# Altium schematic sheet P1.schdoc
size 297 x 209 mm; Company: 嘉立创EDA; Version: V1.0; Page Size: A4; @Project Name: PCB_Base; @Page Count: 1; @Update Date: 2025-12-15; @Create Date: 2025-12-15; @Schematic Name: Schematic1; @Page No: 0; @Page Name: P1; @Board Name: Board1; Border: 1; Title Block Position: 3; Size: A4; Width: 1170; Height: 825; Region Start: 1; X Region Count: 6; Y Region Count: 4; Blade Width: 10; Device: Drawing-Symbol_A4
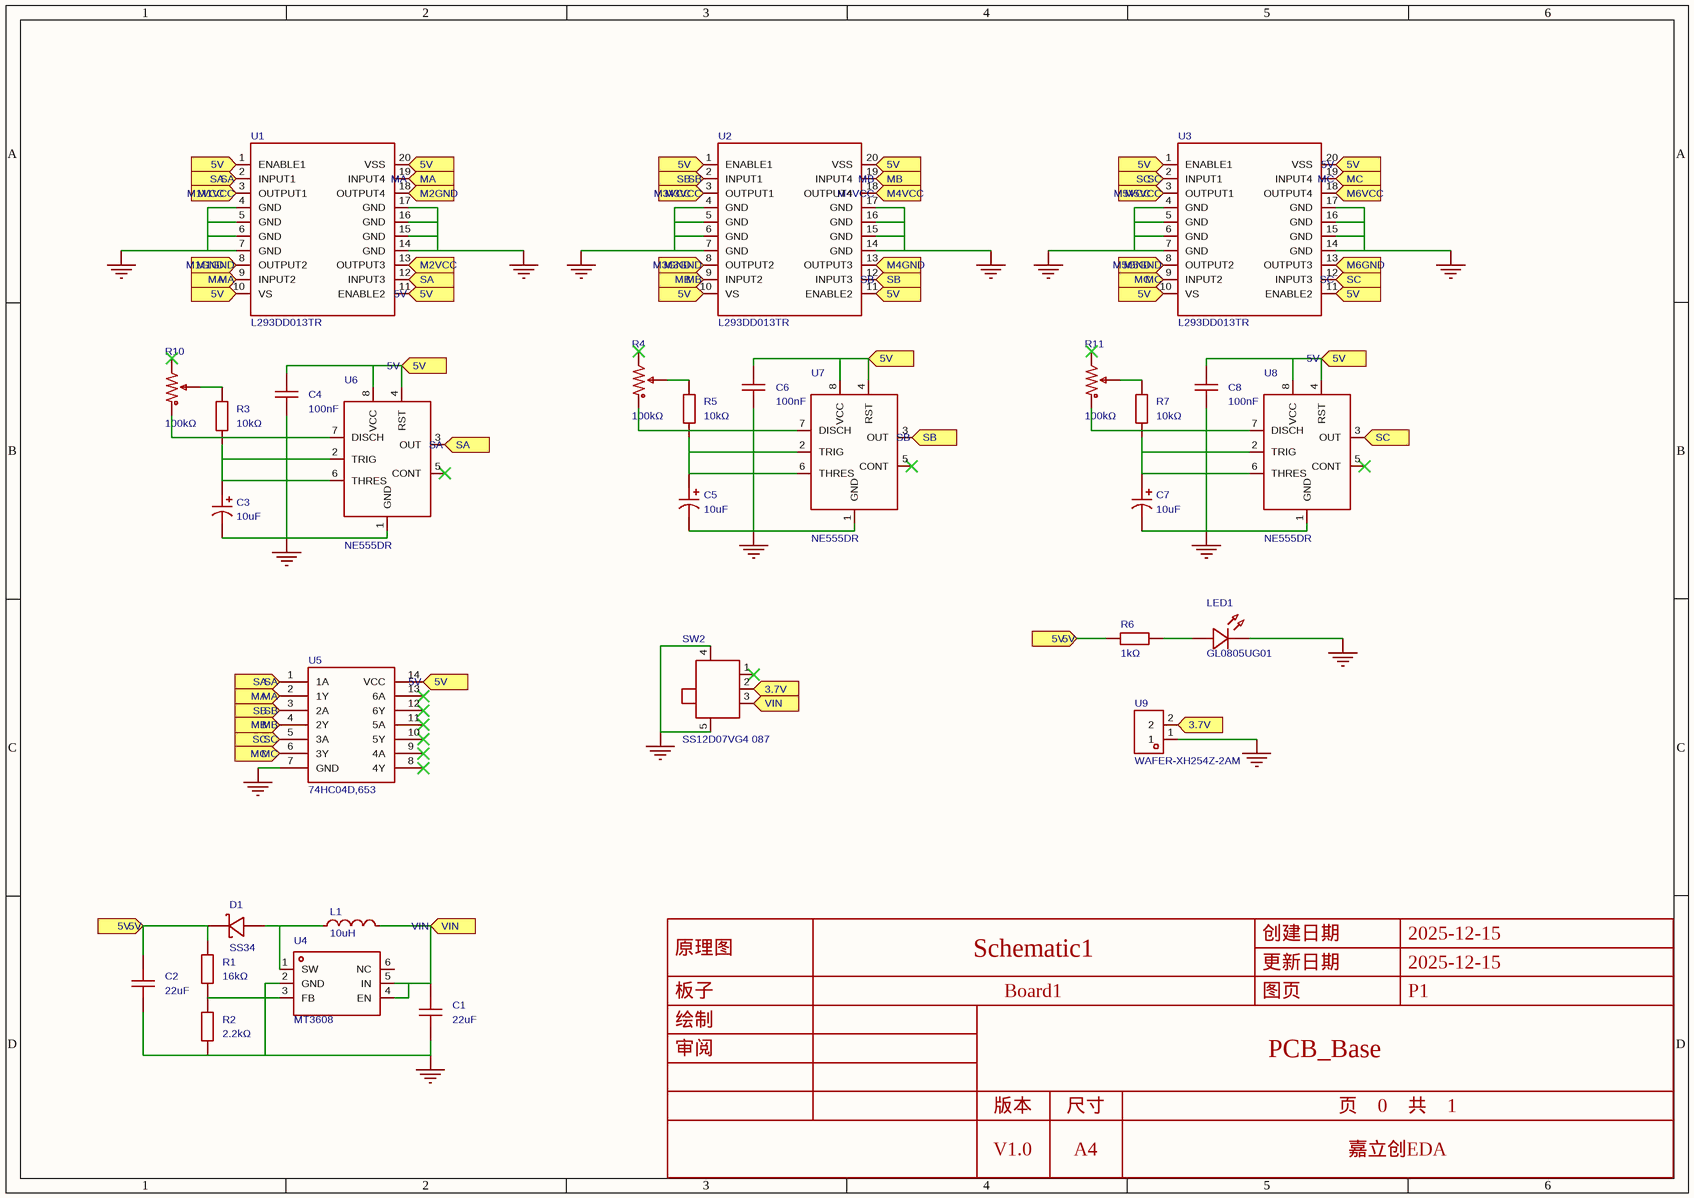
[diagram p0: P1.schdoc]

## Parts
C1  22uF  [C0805]
C2  22uF  [C0805]
C3  10uF  [CAP-SMD_BD4.0-L4.3-W4.3-LS5.1-FD]
C4  100nF  [C0805]
C5  10uF  [CAP-SMD_BD4.0-L4.3-W4.3-LS5.1-FD]
C6  100nF  [C0805]
C7  10uF  [CAP-SMD_BD4.0-L4.3-W4.3-LS5.1-FD]
C8  100nF  [C0805]
D1  SS34  [SMC_L6.9-W5.9-LS7.9-RD]
L1  10uH  [IND-SMD_L7.3-W6.8]
LED1  GL0805UG01  [LED0805-FD]
R1  16kΩ  [R0805]
R2  2.2kΩ  [R0805]
R3  10kΩ  [R0805]
R4  100kΩ  [RES-ADJ-SMD_JER33X-1-14]
R5  10kΩ  [R0805]
R6  1kΩ  [R0805]
R7  10kΩ  [R0805]
R10  100kΩ  [RES-ADJ-SMD_JER33X-1-14]
R11  100kΩ  [RES-ADJ-SMD_JER33X-1-14]
SW2  SS12D07VG4 087  [SW-TH_SS12D07VG4]
U1  L293DD013TR  [SOP-20_L13.2-W7.8-P1.27-LS10.4-BL]
U2  L293DD013TR  [SOP-20_L13.2-W7.8-P1.27-LS10.4-BL]
U3  L293DD013TR  [SOP-20_L13.2-W7.8-P1.27-LS10.4-BL]
U4  MT3608  [SOT-23-6_L2.9-W1.6-P0.95-LS2.8-BL]
U5  74HC04D,653  [SOIC-14_L8.7-W3.9-P1.27-LS6.0-BL]
U6  NE555DR  [SOIC-8_L4.9-W3.9-P1.27-LS6.0-BL]
U7  NE555DR  [SOIC-8_L4.9-W3.9-P1.27-LS6.0-BL]
U8  NE555DR  [SOIC-8_L4.9-W3.9-P1.27-LS6.0-BL]
U9  WAFER-XH254Z-2AM  [CONN-TH_2P-P2.50_XH-2A_3045048]

## Ports
3.7V (in), 5V (in), M1GND (in), M1VCC (in), M2GND (in), M2VCC (in), M3GND (in), M3VCC (in), M4GND (in), M4VCC (in), M5GND (in), M5VCC (in), M6GND (in), M6VCC (in), MA (in), MB (in), MC (in), SA (in), SB (in), SC (in), VIN (in)

## Nets
GND: C1.2 C2.2 C3.2 C4.1 C5.2 C6.1 C7.2 C8.1 LED1.2(C) R2.1 SW2.4 SW2.5 U1.4(GND) U1.5(GND) U1.6(GND) U1.7(GND) U1.14(GND) U1.15(GND) U1.16(GND) U1.17(GND) U2.4(GND) U2.5(GND) U2.6(GND) U2.7(GND) U2.14(GND) U2.15(GND) U2.16(GND) U2.17(GND) U3.4(GND) U3.5(GND) U3.6(GND) U3.7(GND) U3.14(GND) U3.15(GND) U3.16(GND) U3.17(GND) U4.2(GND) U5.7(GND) U6.1(GND) U7.1(GND) U8.1(GND) U9.1
3.7V: SW2.2 U9.2 ; port 3.7V
5V: C2.1 C4.2 C6.2 C8.2 D1.1(C) R1.2 R6.1 U1.1(ENABLE1) U1.10(VS) U1.11(ENABLE2) U1.20(VSS) U2.1(ENABLE1) U2.10(VS) U2.11(ENABLE2) U2.20(VSS) U3.1(ENABLE1) U3.10(VS) U3.11(ENABLE2) U3.20(VSS) U5.14(VCC) U6.4(RST) U6.8(VCC) U7.4(RST) U7.8(VCC) U8.4(RST) U8.8(VCC) ; port 5V
M1GND: U1.8(OUTPUT2) ; port M1GND
M1VCC: U1.3(OUTPUT1) ; port M1VCC
M2GND: U1.18(OUTPUT4) ; port M2GND
M2VCC: U1.13(OUTPUT3) ; port M2VCC
M3GND: U2.8(OUTPUT2) ; port M3GND
M3VCC: U2.3(OUTPUT1) ; port M3VCC
M4GND: U2.13(OUTPUT3) ; port M4GND
M4VCC: U2.18(OUTPUT4) ; port M4VCC
M5GND: U3.8(OUTPUT2) ; port M5GND
M5VCC: U3.3(OUTPUT1) ; port M5VCC
M6GND: U3.13(OUTPUT3) ; port M6GND
M6VCC: U3.18(OUTPUT4) ; port M6VCC
MA: U1.9(INPUT2) U1.19(INPUT4) U5.2(1Y) ; port MA
MB: U2.9(INPUT2) U2.19(INPUT4) U5.4(2Y) ; port MB
MC: U3.9(INPUT2) U3.19(INPUT4) U5.6(3Y) ; port MC
SA: U1.2(INPUT1) U1.12(INPUT3) U5.1(1A) U6.3(OUT) ; port SA
SB: U2.2(INPUT1) U2.12(INPUT3) U5.3(2A) U7.3(OUT) ; port SB
SC: U3.2(INPUT1) U3.12(INPUT3) U5.5(3A) U8.3(OUT) ; port SC
VIN: C1.1 L1.2 SW2.3 U4.4(EN) U4.5(IN) ; port VIN
NetC3_1: C3.1 R3.1 U6.2(TRIG) U6.6(THRES)
NetC5_1: C5.1 R5.1 U7.2(TRIG) U7.6(THRES)
NetC7_1: C7.1 R7.1 U8.2(TRIG) U8.6(THRES)
NetD1_2: D1.2(A) L1.1 U4.1(SW)
NetLED1_1: LED1.1(A) R6.2
NetR1_1: R1.1 R2.2 U4.3(FB)
NetR3_2: R3.2 R10.2
NetR4_1: R4.1 U7.7(DISCH)
NetR4_2: R4.2 R5.2
NetR7_2: R7.2 R11.2
NetR10_1: R10.1 U6.7(DISCH)
NetR11_1: R11.1 U8.7(DISCH)

Not connected (* = marked no-connect by the designer): R4 3*; R10 3*; R11 3*; SW2 1*; U4 6(NC); U5 8(4Y)* 9(4A)* 10(5Y)* 11(5A)* 12(6Y)* 13(6A)*; U6 5(CONT)*; U7 5(CONT)*; U8 5(CONT)*

## Notes on the sheet
- 创建日期
- 2025-12-15
- 原理图
- 板子
- Schematic1
- Board1
- 更新日期
- 图页
- P1
- 绘制
- 审阅
- PCB_Base
- 版本
- V1.0
- 尺寸
- A4
- 页    0    共    1
- 嘉立创EDA

## Library data of the parts
C1 C2 = CGA0805X5R226M350MT: 容值:22uF;精度:±20%;额定电压:35V;材质(温度系数):X5R;; Manufacturer: HRE(芯声); AddInBom: yes; ModelId: 1ba041120af144c991958decab20d2410819f05c4eef4c71ace90d822a990e87; ModelName: C0805_L2.0-W1.3-H1.3; ModelTransform: 78.74,51.181,0,0,0,0,0,0.0005,0; Tolerance: ±20%; Voltage Rated: 35V; Temperature Coefficient: X5R; Symbol: CGA0805X5R226M350MT; Device: CGA0805X5R226M350MT; LCSC Part Name: 22uF ±20% 35V; SupplierPart: C6119901; ManufacturerPart: CGA0805X5R226M350MT; Supplier Footprint: 0805; JLCPCB Part Class: Extended Part; Datasheet: https://atta.szlcsc.com/upload/public/pdf/source/20231129/D589D0CC4D260F7AC3A77E53B455CCB3.pdf; Supplier: LCSC; ConvertToPcb: yes; FootprintName: C0805; Value: 22uF
C3 C5 C7 = JVJ25V10M4x6: 容值:10uF;精度:±20%;额定电压:25V;纹波电流:14mA@120Hz;等效串联电阻(ESR):-;; Manufacturer: JIERR(捷而瑞); AddInBom: yes; ModelId: ab6081afcc4c4b3987ae79516c06d63b0819f05c4eef4c71ace90d822a990e87; ModelTransform: 200.787,169.291,0,180,0,0,0,0,0; Tolerance: ±20%; Voltage Rating: 25V; Lifetime: 2000hrs@105℃; Symbol: JVJ25V10M4X6; Device: JVJ25V10M4x6; LCSC Part Name: 10uF ±20% 25V; SupplierPart: C46550403; ManufacturerPart: JVJ25V10M4x6; Supplier Footprint: SMD,D4xL5.7mm; JLCPCB Part Class: Extended Part; Datasheet: https://item.szlcsc.com/datasheet/JVJ25V10M4x6/48680097.html; Supplier: LCSC; ConvertToPcb: yes; FootprintName: CAP-SMD_BD4.0-L4.3-W4.3-LS5.1-FD; ModelName: CAP-SMD_BD4.0-L4.3-W4.3-LS5.1-FD; Value: 10uF; Ripple Current: 14mA@120Hz; Equivalent Series Resistance(ESR): -; Diameter: 4mm; Height - Seated (Max): 5.7mm; Operating Temperature: -55℃~+105℃
C4 C6 C8 = CL21B104KBCNNNC: 容值:100nF;精度:±10%;额定电压:50V;温度系数:X7R;; Manufacturer: SAMSUNG(三星); AddInBom: yes; ModelId: 1ba041120af144c991958decab20d2410819f05c4eef4c71ace90d822a990e87; ModelName: C0805_L2.0-W1.3-H1.3; ModelTransform: 78.74,51.181,0,0,0,0,0,0.0005,0; Tolerance: ±10%; Voltage Rating: 50V; Temperature Coefficient: X7R; Symbol: CL21B104KBCNNNC; Device: CL21B104KBCNNNC; LCSC Part Name: 100nF ±10% 50V; SupplierPart: C1711; ManufacturerPart: CL21B104KBCNNNC; Supplier Footprint: 0805; JLCPCB Part Class: Extended Part; Datasheet: https://item.szlcsc.com/datasheet/CL21B104KBCNNNC/2063.html; Supplier: LCSC; ConvertToPcb: yes; FootprintName: C0805; Value: 100nF
D1 = SS34_C154551: 正向压降(Vf):500mV@3A;直流反向耐压(Vr):40V;整流电流:3A;; Manufacturer: onsemi(安森美); AddInBom: yes; ModelId: 181deed3e51b4528a83dd624c23bafda0819f05c4eef4c71ace90d822a990e87; ModelTransform: 314.96,236.22,0,0,0,0,0,0,0; Voltage - DC Reverse(Vr): 40V; Current - Rectified: 3A; Reverse Leakage Current (Ir): 500uA@40V; Operating Junction Temperature Range: -55℃~+150℃; Non-Repetitive Peak Forward Surge Current: 100A; Symbol: SS34_C154551; Device: SS34_C154551; LCSC Part Name: 电压:40V 电流:3A; SupplierPart: C154551; ManufacturerPart: SS34; Supplier Footprint: SMC(DO-214AB); JLCPCB Part Class: Extended Part; Datasheet: https://item.szlcsc.com/datasheet/SS34/165893.html; Supplier: LCSC; ConvertToPcb: yes; FootprintName: SMC_L6.9-W5.9-LS7.9-RD; ModelName: SMC_L6.9-W5.9-LS7.9-RD; Voltage - Forward(Vf@If): 500mV@3A
L1 = FXL0630-100-M: 电感值:10uH;精度:±20%;额定电流:4.5A;饱和电流(Isat):5.5A;类型:一体成型电感;; Manufacturer: cjiang(长江微电); AddInBom: yes; ModelId: e28854526ca747668ea12fbe1dd39a630819f05c4eef4c71ace90d822a990e87; ModelName: IND-SMD_L7.3-W6.8-H3.0; ModelTransform: 292.125,267.716,0,0,0,0,0,0,0; Tolerance: ±20%; Rated Current: 4.5A; Saturation Current (Isat): 5.5A; DC Resistance (DCR): 68mΩ; Type: 一体成型电感; Symbol: FXL0630-100-M; Device: FXL0630-100-M; LCSC Part Name: 10uH ±20% 5.5A; SupplierPart: C167223; ManufacturerPart: FXL0630-100-M; Supplier Footprint: SMD,6.6x7mm; JLCPCB Part Class: Extended Part; Datasheet: https://atta.szlcsc.com/upload/public/pdf/source/20240426/3189EA8206330E2108542F9E34E540E7.pdf; Supplier: LCSC; ConvertToPcb: yes; FootprintName: IND-SMD_L7.3-W6.8; Value: 10uH; Ratings: -
LED1 = GL0805UG01: 灯头类型:-;发光颜色:翠绿色;正向压降(Vf):3.1V;功率:-;正向电流:5mA;波长:510nm~531nm;二极管配置:独立二极管;透镜颜色:无色透明透镜;色温:-;发光强度:299mcd;发光角度:120°;载带方式:正贴;工作温度:-40℃~+85℃;; Manufacturer: Guiguang light(桂光光电); AddInBom: yes; ModelId: 74833d193aea448a9f613f55d84508ab0819f05c4eef4c71ace90d822a990e87; ModelName: LED0805_Inf; ModelTransform: 78.74,49.213,0,0,0,0,0,0,0; Illumination Color: 翠绿色; Voltage - Forward(Vf): 3.1V; Forward Current: 5mA; Diode Configuration: 独立二极管; Lens Color: 无色透明透镜; Luminous Intensity: 299mcd; Viewing Angle: 120°; Symbol: GL0805UG01; Device: GL0805UG01; LCSC Part Name: 0805 翠绿 高亮; SupplierPart: C51933308; ManufacturerPart: GL0805UG01; Supplier Footprint: 0805; JLCPCB Part Class: Extended Part; Datasheet: https://item.szlcsc.com/datasheet/GL0805UG01/54646004.html; Supplier: LCSC; ConvertToPcb: yes; FootprintName: LED0805-FD; Lamp Holder Type: -; Power(Watts): -; Wavelength - Dominant: 510nm~531nm; Peak Wavelength: -; Color Temperature: -; Mounting Style: 正贴; Operating Temperature: -40℃~+85℃
R1 = 0805W8F1602T5E: 电阻类型:厚膜电阻;阻值:16kΩ;精度:±1%;功率:125mW;工作电压:150V;温度系数:±100ppm/℃;; Manufacturer: UNI-ROYAL(厚声); AddInBom: yes; ModelId: 37a81e68749a4138bd2dfa6897b24b850819f05c4eef4c71ace90d822a990e87; ModelName: R0805_L2.0-W1.3-H0.6; ModelTransform: 78.74,51.181,0,0,0,0,0,-0.0005,0; Tolerance: ±1%; Power(Watts): 125mW; Voltage-Supply(Max): 150V; Symbol: 0805W8F1602T5E; Device: 0805W8F1602T5E; LCSC Part Name: 16kΩ ±1% 125mW 厚膜电阻; SupplierPart: C17490; ManufacturerPart: 0805W8F1602T5E; Supplier Footprint: 0805; JLCPCB Part Class: Extended Part; Datasheet: https://item.szlcsc.com/datasheet/0805W8F1602T5E/18178.html; Supplier: LCSC; ConvertToPcb: yes; FootprintName: R0805; Type: 厚膜电阻; Value: 16kΩ; Temperature Coefficient: ±100ppm/℃; Operating Temperature: -55℃~+155℃
R2 = 0805W8F2201T5E: 电阻类型:厚膜电阻;阻值:2.2kΩ;精度:±1%;功率:125mW;工作电压:150V;温度系数:±100ppm/℃;; Manufacturer: UNI-ROYAL(厚声); AddInBom: yes; ModelId: 37a81e68749a4138bd2dfa6897b24b850819f05c4eef4c71ace90d822a990e87; ModelName: R0805_L2.0-W1.3-H0.6; ModelTransform: 78.74,51.181,0,0,0,0,0,-0.0005,0; Tolerance: ±1%; Power(Watts): 125mW; Voltage-Supply(Max): 150V; Symbol: 0805W8F2201T5E; Device: 0805W8F2201T5E; LCSC Part Name: 2.2kΩ ±1% 125mW 厚膜电阻; SupplierPart: C17520; ManufacturerPart: 0805W8F2201T5E; Supplier Footprint: 0805; JLCPCB Part Class: Basic Part; Datasheet: https://item.szlcsc.com/datasheet/0805W8F2201T5E/18208.html; Supplier: LCSC; ConvertToPcb: yes; FootprintName: R0805; Type: 厚膜电阻; Value: 2.2kΩ; Temperature Coefficient: ±100ppm/℃; Operating Temperature: -55℃~+155℃
R3 R5 R7 = 0805W8F1002T5E_C17414: 电阻类型:厚膜电阻;阻值:10kΩ;精度:±1%;功率:125mW;工作电压:150V;温度系数:±100ppm/℃;; Manufacturer: UNI-ROYAL(厚声); AddInBom: yes; ModelId: 37a81e68749a4138bd2dfa6897b24b850819f05c4eef4c71ace90d822a990e87; ModelName: R0805_L2.0-W1.3-H0.6; ModelTransform: 78.74,51.181,0,0,0,0,0,-0.0005,0; Tolerance: ±1%; Power(Watts): 125mW; Voltage-Supply(Max): 150V; Symbol: 0805W8F1002T5E; Device: 0805W8F1002T5E_C17414; LCSC Part Name: 10kΩ ±1% 125mW 厚膜电阻; SupplierPart: C17414; ManufacturerPart: 0805W8F1002T5E; Supplier Footprint: 0805; JLCPCB Part Class: Basic Part; Datasheet: https://item.szlcsc.com/datasheet/0805W8F1002T5E/18102.html; Supplier: LCSC; ConvertToPcb: yes; FootprintName: R0805; Type: 厚膜电阻; Value: 10kΩ; Temperature Coefficient: ±100ppm/℃; Operating Temperature: -55℃~+155℃
R4 R10 R11 = JER33X-1-15: 阻值:100kΩ;精度:±25%;功率:150mW;温度系数:±250ppm/℃;; Manufacturer: JIERR(捷而瑞); AddInBom: yes; ModelId: de65341884c4454393239133889d31970819f05c4eef4c71ace90d822a990e87; ModelTransform: 120.4722,150,0,0,0,0,0,0,0; Tolerance: ±25%; Power(Watts): 150mW; Number of Turns: 1; Symbol: JER33X-1-15; Device: JER33X-1-15; LCSC Part Name: JER33X-1-15; SupplierPart: C48997895; ManufacturerPart: JER33X-1-15; Supplier Footprint: SMD-3P,3.4x3.1mm; JLCPCB Part Class: Extended Part; Datasheet: https://item.szlcsc.com/datasheet/JER33X-1-15/51342031.html; Supplier: LCSC; ConvertToPcb: yes; FootprintName: RES-ADJ-SMD_JER33X-1-14; ModelName: RES-ADJ-SMD_JER33X-1-14; Value: 100kΩ; Temperature Coefficient: ±250ppm/℃
R6 = 0805W8F1001T5E: 电阻类型:厚膜电阻;阻值:1kΩ;精度:±1%;功率:125mW;最大工作电压:150V;温度系数:±100ppm/℃;; Manufacturer: UNI-ROYAL(厚声); AddInBom: yes; ModelId: 37a81e68749a4138bd2dfa6897b24b850819f05c4eef4c71ace90d822a990e87; ModelName: R0805_L2.0-W1.3-H0.6; ModelTransform: 78.74,51.181,0,0,0,0,0,-0.0005,0; Tolerance: ±1%; Power(Watts): 125mW; Overload Voltage (Max): 150V; Symbol: 0805W8F1001T5E; Device: 0805W8F1001T5E; LCSC Part Name: 1kΩ ±1% 125mW 厚膜电阻; SupplierPart: C17513; ManufacturerPart: 0805W8F1001T5E; Supplier Footprint: 0805; JLCPCB Part Class: Basic Part; Datasheet: https://atta.szlcsc.com/upload/public/pdf/source/20200306/C422600_1E6D84923E4A46A82E41ADD87F860B5C.pdf; Supplier: LCSC; ConvertToPcb: yes; FootprintName: R0805; Type: 厚膜电阻; Value: 1kΩ; Temperature Coefficient: ±100ppm/℃; Operating Temperature Range: -55℃~+155℃
SW2 = SS12D07VG4 087: 电路结构:单刀双掷;安装方式:直插;开关颜色:-;额定电流:500mA;额定电压:50V;工作寿命:5千次;; Manufacturer: SHOU HAN(首韩); AddInBom: yes; ModelId: 8e9c0e123f4944c8b06c415643703e370819f05c4eef4c71ace90d822a990e87; ModelTransform: 346.456,181.102,0,180,0,0,0,0,-110.236; Circuit: 单刀双掷; Switch Height: 4.7mm; Current Rating: 500mA; Voltage Rating: 50V; Life: 5千次; Symbol: SS12D07VG4 087; Device: SS12D07VG4 087; LCSC Part Name: SS12D07VG4 087; SupplierPart: C2939726; ManufacturerPart: SS12D07VG4 087; Supplier Footprint: 插件,8.7x4.4mm; JLCPCB Part Class: Extended Part; Datasheet: https://item.szlcsc.com/datasheet/SS12D07VG4%2520087/3301205.html; Supplier: LCSC; ConvertToPcb: yes; FootprintName: SW-TH_SS12D07VG4; ModelName: SW-TH_SS12D07VG4; Actuator Style: -; Termination Style: PC引脚; Length: 8.7mm; Width: 4.4mm; Mounting Type: 直插; Actuator Color: -; Operating Temperature: -10℃~+50℃
U1-U3 = L293DD013TR: 具有二极管的推挽四通道驱动器; Manufacturer: ST(意法半导体); AddInBom: yes; ModelId: 5d9138bc5b9348abbb3c77fe4eae4eaa0819f05c4eef4c71ace90d822a990e87; ModelName: SOP-20_L12.8-W7.5-H2.5-LS10.3-P1.27; ModelTransform: 503.936,405.511,0,0,0,0,0,0.0005,0; Symbol: L293DD013TR; Device: L293DD013TR; LCSC Part Name: 600mA 有刷直流电机驱动芯片 36V; SupplierPart: C21610; ManufacturerPart: L293DD013TR; Supplier Footprint: SOIC-20-300mil; JLCPCB Part Class: Extended Part; Datasheet: https://item.szlcsc.com/datasheet/L293DD013TR/22331.html; Supplier: LCSC; ConvertToPcb: yes; FootprintName: SOP-20_L13.2-W7.8-P1.27-LS10.4-BL
U4 = MT3608: 功能类型:升压型;输出类型:可调;工作电压:2V~24V;输出电压:-;输出电流:2A;; Manufacturer: 西安航天民芯; AddInBom: yes; ModelId: 18da8f6c14a34920b3e136b5c401a1190819f05c4eef4c71ace90d822a990e87; ModelName: SOT-23-6_L2.9-W1.6-H1.5-LS2.8-P0.95; ModelTransform: 110.236,113.364,0,90,0,0,0.0005,0.0005,0; Function: 升压型; Output Type: 可调; Voltage - Supply: 2V~24V; Output Current: 2A; Frequency - Switching: 1.2MHz; Synchronous Rectifier: 否; Number of Outputs: 1; Topology: 升压式; Quiescent Current: 100uA；1.6mA; Switch tube (built-in/external): 内置; Symbol: MT3608; Device: MT3608; LCSC Part Name: 老版本 高效1.2MHz 2A升压转换器; SupplierPart: C84817; ManufacturerPart: MT3608; Supplier Footprint: SOT-23-6; JLCPCB Part Class: Extended Part; Datasheet: https://item.szlcsc.com/datasheet/MT3608/85988.html; Supplier: LCSC; ConvertToPcb: yes; FootprintName: SOT-23-6_L2.9-W1.6-P0.95-LS2.8-BL; Output Voltage: -; Operating Temperature: -40℃~+85℃
U5 = 74HC04D,653: 输入类型:-;电源电压:2V~6V;供电电流(最大值):2uA;电路数:6;最大传播延迟(tpd):14ns@6V,50pF;; Manufacturer: Nexperia(安世); AddInBom: yes; ModelId: 8dbf5b715d42428c85558507ae5a252b0819f05c4eef4c71ace90d822a990e87; ModelName: SOIC-14_L8.6-W3.9-H1.8-LS6.0-P1.27; ModelTransform: 338.583,236.22,0,0,0,0,0,-0.001,0; Supply Voltage(Single): 2V~6V; Supply Current (Max): 2uA; Number of Circuits: 6; Number of Inputs: 1; Sink Current: 5.2mA; High level range (VIH): 1.5V~4.2V; Low level range (VIL): 500mV~1.8V; Symbol: 74HC04D,653; Device: 74HC04D,653; LCSC Part Name: 六路反相器; SupplierPart: C5590; ManufacturerPart: 74HC04D,653; Supplier Footprint: SOIC-14; JLCPCB Part Class: Extended Part; Datasheet: https://atta.szlcsc.com/upload/public/pdf/source/20170918/C131317_1505726905601976309.pdf; Supplier: LCSC; ConvertToPcb: yes; FootprintName: SOIC-14_L8.7-W3.9-P1.27-LS6.0-BL; Input Type: -; Source Current: 5.2mA; Max Propagation Delay: 14ns@6V,50pF; Series: 74HC系列; Operating Temperature: -40℃~+125℃
U6-U8 = NE555DR_C7593: NE555 单精度定时器; Manufacturer: TI(德州仪器); AddInBom: yes; ModelId: e81d2f7d937b4a6ab1dca543ff5d56a40819f05c4eef4c71ace90d822a990e87; ModelName: SOIC-8_L4.9-W3.9-H1.7-LS6.0-P1.27; ModelTransform: 189.751,236.22,0,0,0,0,0.0005,0.0005,0; Symbol: NE555DR; Device: NE555DR_C7593; LCSC Part Name: NE555DR; SupplierPart: C7593; ManufacturerPart: NE555DR; Supplier Footprint: SOIC-8; JLCPCB Part Class: Extended Part; Datasheet: https://www.ti.com/cn/lit/gpn/sa555; Supplier: LCSC; ConvertToPcb: yes; FootprintName: SOIC-8_L4.9-W3.9-P1.27-LS6.0-BL
U9 = WAFER-XH254Z-2AM: 插针结构:1x2P;间距:2.54mm;安装方式:直插;参考系列:XH;总PIN数:2P;排数:1;每排PIN数:2;额定电流:3A;触头材质:黄铜;工作温度:-25℃~+85℃;; Manufacturer: HANBO(汉博); AddInBom: yes; ModelId: a03ee9acfa8e4e25b912a99a3551fb920819f05c4eef4c71ace90d822a990e87; ModelTransform: 295.275,228.7397,0,0,0,0,0,21.654,-133.858; Pins Structure: 1x2P; Pitch: 2.54mm; Reference Series: XH; Number of PINs Per Row: 2; Current Rating: 3A; Voltage Rating: 250V; Plastic Material: PA66; Flame Retardant Rating: UL94V-0; Symbol: WAFER-XH254Z-2AM; Device: WAFER-XH254Z-2AM; LCSC Part Name: 1x2P 间距:2.54mm 直插 系列:XH; SupplierPart: C22751822; ManufacturerPart: WAFER-XH254Z-2AM; Supplier Footprint: 插件,P=2.54mm; JLCPCB Part Class: Extended Part; Datasheet: https://item.szlcsc.com/datasheet/WAFER-XH254Z-2AM/24478757.html; Supplier: LCSC; ConvertToPcb: yes; FootprintName: CONN-TH_2P-P2.50_XH-2A_3045048; ModelName: CONN-TH_2P-P2.50_XH-2A_3045048; Mounting Type: 直插; Number of Pins: 2P; Number of Rows: 1; Contact Material: 黄铜; Operating Temperature: -25℃~+85℃